# Altium schematic sheet Power_Line_12V.SchDoc: PDM
size A3; SheetNumber: 4; SheetTotal: 6
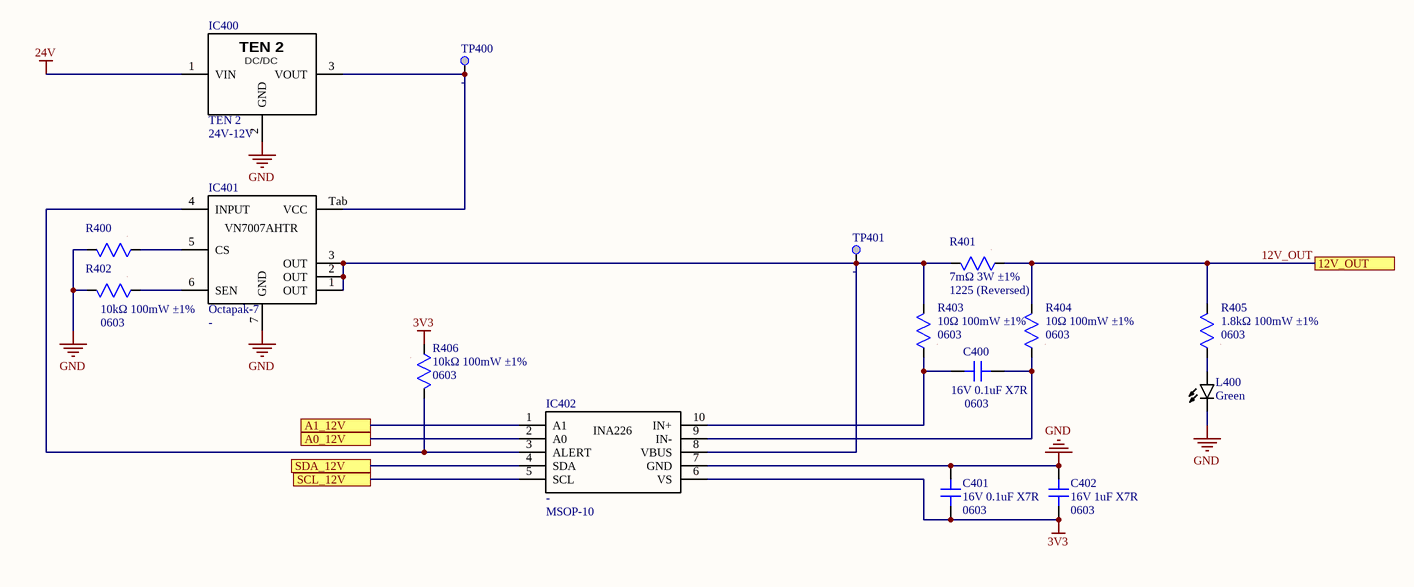
[diagram p0: Power_Line_12V.SchDoc]

## Parts
C400  value 16V 0.1uF X7R  Package: 0603  [CAP SMD 0603]  (hidden comment: CAP non polarized)
C401  value 16V 0.1uF X7R  Package: 0603  [CAP SMD 0603]  (hidden comment: CAP non polarized)
C402  value 16V 1uF X7R  Package: 0603  [CAP SMD 0603]  (hidden comment: CAP non polarized)
IC400  TEN 2  value 24V-12V  [TEN 2]
IC401  VN7007AHTR  [Octapak-7]  (value not drawn)
IC402  Package: MSOP-10  [VSOP-10]  (hidden comment: INA226)
L400  value Green  [LED SMD 0603]  (hidden comment: LED WHITE)
R400  RES  [RES SMD 0603]  (value not drawn)
R401  value 7mΩ 3W ±1%  Package: 1225 (Reversed)  [RES SMD 1225 Reversed]  (hidden comment: RES)
R402  value 10kΩ 100mW ±1%  Package: 0603  [RES SMD 0603]  (hidden comment: RES)
R403  value 10Ω 100mW ±1%  Package: 0603  [RES SMD 0603]  (hidden comment: RES)
R404  value 10Ω 100mW ±1%  Package: 0603  [RES SMD 0603]  (hidden comment: RES)
R405  value 1.8kΩ 100mW ±1%  Package: 0603  [RES SMD 0603]  (hidden comment: RES)
R406  value 10kΩ 100mW ±1%  Package: 0603  [RES SMD 0603]  (hidden comment: RES)
TP400  Test Point  [TP_SMD_1MM]  (value not drawn)  (no BOM)
TP401  Test Point  [TP_SMD_1MM]  (value not drawn)  (no BOM)

## Ports
12V_OUT, A0_12V, A1_12V, SCL_12V, SDA_12V

## Nets
3V3: C401.2 C402.2 IC402.6(VS) R406.1
24V: IC400.1(VIN)
GND: C401.1 C402.1 IC400.2(GND) IC401.7(GND) IC402.7(GND) L400.C R400.2 R402.2
12V_OUT: R401.1 R404.2 R405.2 ; port 12V_OUT
A0_12V: IC402.2(A0) ; port A0_12V
A1_12V: IC402.1(A1) ; port A1_12V
SCL_12V: IC402.5(SCL) ; port SCL_12V
SDA_12V: IC402.4(SDA) ; port SDA_12V
NetC400_1: C400.1 IC402.10(IN+) R403.1
NetC400_2: C400.2 IC402.9(IN-) R404.1
NetIC400_3: IC400.3(VOUT) IC401.Tab(VCC) TP400.1
NetIC401_1: IC401.1(OUT) IC401.2(OUT) IC401.3(OUT) IC402.8(VBUS) R401.2 R403.2 TP401.1
NetIC401_4: IC401.4(INPUT) IC402.3(ALERT) R406.2
NetIC401_5: IC401.5(CS) R400.1
NetIC401_6: IC401.6(SEN) R402.1
NetL400_A: L400.A R405.1

## Notes on the sheet
- Project:
- Subsystem:
- Company:
- Document:
- Author:
- Revision:
- Date:
- Sheet:
- /
- (in symbol 070-0003) DC/DC

## Library data of the parts
C400 C401 = 001-0112: Condensadores de cerámica multicapa (MLCC- SMD/SMT) WCAP-CSGP 0.1uF 0603 10% 16V MLCC; MPN: 885012206046; Manufacturer: Wurth Elektronik; ComponentLink1Description: Datasheet; ComponentLink1URL: https://www.we-online.com/components/products/datasheet/885012206046.pdf; ComponentLink2Description: Distributor Link; ComponentLink2URL: https://www.mouser.es/ProductDetail/Wurth-Elektronik/885012206046?qs=0KOYDY2FL2%252B89gr6HvTBXA%3D%3D; ID: 001-0112; Distributor PN: 710-885012206046; Distributor: Mouser
C402 = 001-0110: Condensadores de cerámica multicapa (MLCC- SMD/SMT) WCAP-CSGP 1uF 0603 10% 16V MLCC; MPN: 885012206052; Manufacturer: Wurth Elektronik; ComponentLink1Description: Datasheet; ComponentLink1URL: https://www.we-online.com/components/products/datasheet/885012206052.pdf; ComponentLink2Description: Distributor Link; ComponentLink2URL: https://www.mouser.es/ProductDetail/Wurth-Elektronik/885012206052?qs=0KOYDY2FL2%2F2JKabApojcQ%3D%3D; ID: 001-0110; Distributor PN: 710-885012206052; Distributor: Mouser
IC400 = 070-0003: Convertidores DC/DC para montaje pasante 15-36Vin 12V 2A SIP switching regulator; MPN: TSR 2-24120; Manufacturer: TRACO Power; ComponentLink1Description: Datasheet; ComponentLink1URL: https://www.tracopower.com/tsr2-datasheet; ComponentLink2Description: Distributor Link; ComponentLink2URL: https://www.mouser.es/ProductDetail/TRACO-Power/TSR-2-24120?qs=NtE2QagKf6T34HiGRDOLrw%3D%3D; ID: 070-0003; Package: 14.0x7.5x10.1mm; Distributor PN: 495-TSR2-24120; Distributor: Mouser
IC401 = 050-0002: Controlador de puerta High side driver with current sense analog feedback for automotive applications; Manufacturer: 511-VN7007AHTR; ComponentLink1Description: Datasheet; ComponentLink1URL: https://www.st.com/resource/en/datasheet/vn7007ah.pdf; ComponentLink2Description: Distributor Link; ComponentLink2URL: https://www.mouser.es/ProductDetail/STMicroelectronics/VN7007AHTR?qs=mKNKSX85ZJecQmIqUrqpTA%3D%3D; ID: 050-0002; Value: -; Package: Octapak-7; MPN: VN7007AHTR; Distributor PN: STMicroelectronics; Distributor: Mouser
IC402 = 050-0001: Monitores y reguladores de corriente y energía Hi-Side Msmt Bi-Dir Current/Pwr Mon A 59 A 595-INA226AIDGST; MPN: INA226AIDGSR; Manufacturer: 595-INA226AIDGSR; ComponentLink1Description: Datasheet; ComponentLink1URL: https://www.ti.com/lit/ds/symlink/ina226.pdf?ts=1772078114731&ref_url=https%253A%252F%252Fwww.ti.com%252Fproduct%252FINA226; ComponentLink2Description: Distributor Link; ComponentLink2URL: https://www.mouser.es/ProductDetail/Texas-Instruments/INA226AIDGSR?qs=tQG3bEuiOZD4quG3egR36g%3D%3D&srsltid=AfmBOopOjh8KVXQVeHwZlO8DxeOetC6-xgaoNkKslHEV4iGJ_SkIIo7K; ID: 050-0001; Value: -; Distributor PN: Texas Instruments; Distributor: Mouser
L400 = 033-0023: LED de un solo color Green 525nm 1400mcd 2.85V 73deg 0603; MPN: VLMTG1400-GS08; Manufacturer: Vishay Semiconductors; ComponentLink1Description: Datasheet; ComponentLink1URL: https://www.vishay.com/docs/84393/vlmtg1400.pdf; ComponentLink2Description: Distributor Link; ComponentLink2URL: https://www.mouser.es/ProductDetail/Vishay-Semiconductors/VLMTG1400-GS08?qs=gt1LBUVyoHlZ6yHd8iEIzQ%3D%3D; ID: 033-0023; Package: 0603; Distributor PN: 78-VLMTG1400-GS08; Distributor: Mouser
R400 = 010-0145: Resistores de película gruesa - SMD WRIS-RSKS 10 kOhms 1 % 0.1 W 0603 AEC-Q200; MPN: 560112116005; Manufacturer: Wurth Elektronik; Value: 10kΩ 100mW ±1%; ComponentLink1Description: Datasheet; ComponentLink1URL: https://www.we-online.com/components/products/datasheet/560112116005.pdf; ComponentLink2Description: Distributor Link; ComponentLink2URL: https://www.mouser.es/ProductDetail/Wurth-Elektronik/560112116005?qs=mELouGlnn3dMVSPHwBGouA%3D%3D; Package: 0603; ID: 010-0145; Distributor PN: 710-560112116005; Distributor: Mouser
R401 = 015-0003: Resistores de detección de corriente - SMD 3W 0.007ohm 1% 50ppm; MPN: KRL6432E-M-R007-F-T1; Manufacturer: Susumu; ComponentLink1Description: Datasheet; ComponentLink1URL: https://www.mouser.es/datasheet/3/826/1/n_catalog_partition19_en.pdf; ComponentLink2Description: Distributor Link; ComponentLink2URL: https://www.mouser.es/ProductDetail/Susumu/KRL6432E-M-R007-F-T1?qs=FG09h9tFCuA5fgBuyupdEw%3D%3D; ID: 015-0003; Distributor PN: 754-KRL6432EMR007FT1; Distributor: Mouser
R402 R406 = 010-0145: Resistores de película gruesa - SMD WRIS-RSKS 10 kOhms 1 % 0.1 W 0603 AEC-Q200; MPN: 560112116005; Manufacturer: Wurth Elektronik; ComponentLink1Description: Datasheet; ComponentLink1URL: https://www.we-online.com/components/products/datasheet/560112116005.pdf; ComponentLink2Description: Distributor Link; ComponentLink2URL: https://www.mouser.es/ProductDetail/Wurth-Elektronik/560112116005?qs=mELouGlnn3dMVSPHwBGouA%3D%3D; ID: 010-0145; Distributor PN: 710-560112116005; Distributor: Mouser
R403 R404 = 010-0149: Resistores de película gruesa - SMD WRIS-RSKS 10 Ohms 1 % 0.1 W 0603 AEC-Q200; MPN: 560112116013; Manufacturer: Wurth Elektronik; ComponentLink1Description: Datasheet; ComponentLink1URL: https://www.we-online.com/components/products/datasheet/560112116013.pdf; ComponentLink2Description: Distributor Link; ComponentLink2URL: https://www.mouser.es/ProductDetail/Wurth-Elektronik/560112116013?qs=mELouGlnn3f7quibYlpocQ%3D%3D; ID: 010-0149; Distributor PN: 710-560112116013; Distributor: Mouser
R405 = 010-0146: Resistores de película gruesa - SMD WRIS-RSKS 1.8 kOhms 1 % 0.1 W 0603 AEC-Q200; MPN: 560112116032; Manufacturer: Wurth Elektronik; ComponentLink1Description: Datasheet; ComponentLink1URL: https://www.we-online.com/components/products/datasheet/560112116032.pdf; ComponentLink2Description: Distributor Link; ComponentLink2URL: https://www.mouser.es/ProductDetail/Wurth-Elektronik/560112116032?qs=mELouGlnn3dPZZEXKb4zAQ%3D%3D; ID: 010-0146; Distributor PN: 710-560112116032; Distributor: Mouser
TP400 TP401 = 110-0007: ComponentLink1URL: -; ComponentLink1Description: Datasheet; ComponentLink1URL: *; ComponentLink2Description: Distributor Link; ComponentLink2URL: -; ID: 110-0007; Value: -; Package: -; MPN: -; Manufacturer: -; Distributor PN: -; Distributor: -